# Altium schematic sheet Charging_TI_2.SchDoc
size A4
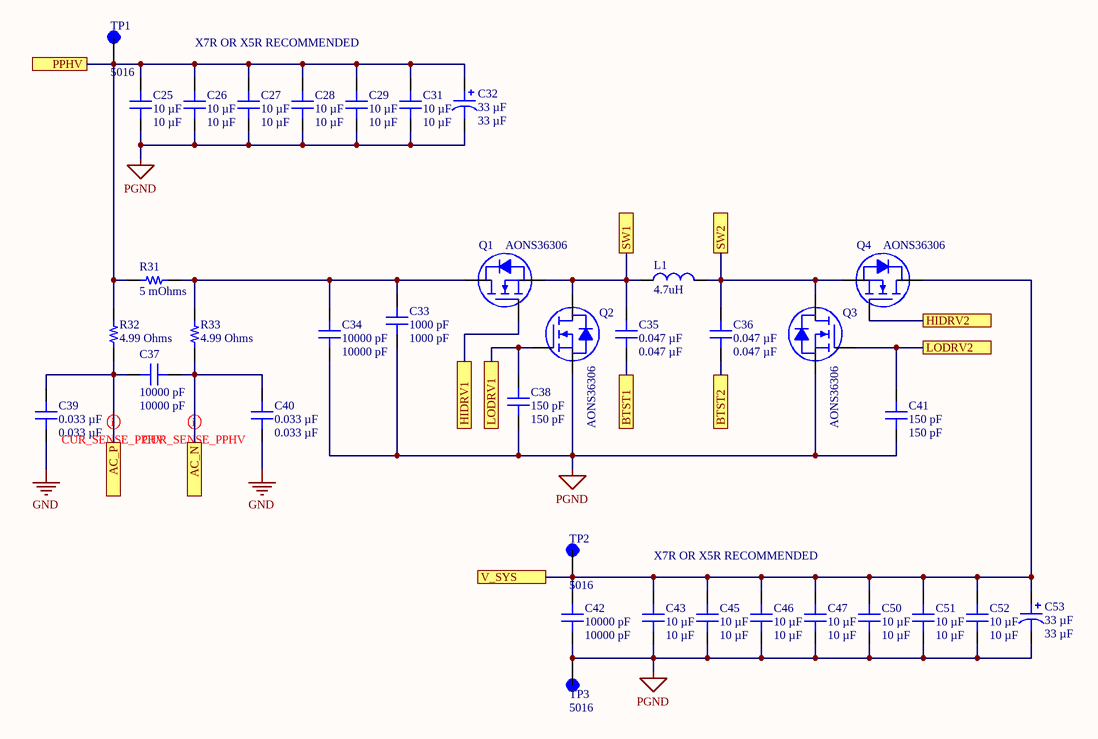
[diagram p0: Charging_TI_2.SchDoc]

## Parts
C25  10 µF  [CAP 0805_2012]
C26  10 µF  [CAP 0805_2012]
C27  10 µF  [CAP 0805_2012]
C28  10 µF  [CAP 0805_2012]
C29  10 µF  [CAP 0805_2012]
C31  10 µF  [CAP 0805_2012]
C32  33 µF  [CAP POL 2917_7343]
C33  1000 pF  [CAP 0402_1005]
C34  10000 pF  [CAP 0402_1005]
C35  0.047 µF  [CAP 0603_1608]
C36  0.047 µF  [CAP 0603_1608]
C37  10000 pF  [CAP 0603_1608]
C38  150 pF  [CAP 0603_1608]
C39  0.033 µF  [CAP 0603_1608]
C40  0.033 µF  [CAP 0603_1608]
C41  150 pF  [CAP 0603_1608]
C42  10000 pF  [CAP 0603_1608]
C43  10 µF  [CAP 0805_2012]
C45  10 µF  [CAP 0805_2012]
C46  10 µF  [CAP 0805_2012]
C47  10 µF  [CAP 0805_2012]
C50  10 µF  [CAP 0805_2012]
C51  10 µF  [CAP 0805_2012]
C52  10 µF  [CAP 0805_2012]
C53  33 µF  [CAP POL 2917_7343]
L1  4.7uH  [BMQADY1010404R7MA1]
Q1  AONS36306  [DFN 5x6]
Q2  AONS36306  [DFN 5x6]
Q3  AONS36306  [DFN 5x6]
Q4  AONS36306  [DFN 5x6]
R31  5 mOhms  [RES 1206_3216]
R32  4.99 Ohms  [RES 0603_1608]
R33  4.99 Ohms  [RES 0603_1608]
TP1  5016  [KEYSTONE_5016]  (no BOM)
TP2  5016  [KEYSTONE_5016]  (no BOM)
TP3  5016  [KEYSTONE_5016]  (no BOM)

## Ports
AC_N, AC_P, BTST1, BTST2, HIDRV1, HIDRV2, LODRV1, LODRV2, PPHV, SW1, SW2, V_SYS

## Nets
GND: C39.1 C40.1
PGND: C25.1 C26.1 C27.1 C28.1 C29.1 C31.1 C32.2 C33.1 C34.1 C38.1 C41.1 C42.1 C43.1 C45.1 C46.1 C47.1 C50.1 C51.1 C52.1 C53.2 Q2.S Q3.S TP3.TP
AC_N: C37.1 C40.2 R33.1 ; port AC_N
AC_P: C37.2 C39.2 R32.1 ; port AC_P
BTST1: C35.1 ; port BTST1
BTST2: C36.1 ; port BTST2
HIDRV1: Q1.G ; port HIDRV1
HIDRV2: Q4.G ; port HIDRV2
LODRV1: C38.2 Q2.G ; port LODRV1
LODRV2: C41.2 Q3.G ; port LODRV2
PPHV: C25.2 C26.2 C27.2 C28.2 C29.2 C31.2 C32.1 R31.1 R32.2 TP1.TP ; port PPHV
SW1: C35.2 L1.1 Q1.S Q2.D ; port SW1
SW2: C36.2 L1.2 Q3.D Q4.S ; port SW2
V_SYS: C42.2 C43.2 C45.2 C46.2 C47.2 C50.2 C51.2 C52.2 C53.1 Q4.D TP2.TP ; port V_SYS
NetC33_2: C33.2 C34.2 Q1.D R31.2 R33.2

## Layout directives
differential pair; differential pair class CUR_SENSE_PPHV: AC_N, AC_P

## Notes on the sheet
- X7R OR X5R RECOMMENDED

## Library data of the parts
C25-C29 C31 C43 C45-C47 C50-C52 = GRM21BR61H106KE43L: CAP CER 10UF 50V X5R 0805; manufacturer: Murata Electronics; Tolerance: ±10%; Part Number: GRM21BR61H106KE43L; Value: 10 µF; Applications: General Purpose; Capacitance: 10 µF; componentlink1description: Datasheet; componentlink1url: https://search.murata.co.jp/Ceramy/image/img/A01X/G101/ENG/GRM21BR61H106KE43-01A.pdf; componentlink2description: DigiKey Link; componentlink2url: https://www.digikey.com/en/products/detail/murata-electronics/GRM21BR61H106KE43L/10326316; Device Package: 0805 (2012 Metric); lastupdated: 14/08/2022 9:12:57 PM; Lifecycle Status: Active; Minimum Order: 1; Mounting Type: Surface Mount, MLCC; Operating Temperature: -55°C ~ 85°C; Package / Case: 0805 (2012 Metric); packaging: TapeAndReel; partid: 39284; Part Status: Active; price: 0.07; series: GRM; Size / Dimension: 0.079" L x 0.049" W (2.00mm x 1.25mm); Supplier 1: DigiKey; Supplier Part Number 1: 490-18663-1-ND; Temperature Coefficient: X5R; Thickness (Max): 0.057" (1.45mm); Voltage - Rated: 50V
C32 C53 = T495X336M035ATE175: CAP TANT 33UF 20% 35V 2917; manufacturer: KEMET; Manufacturer Size Code: X; ESR (Equivalent Series Resistance): 175mOhm; Lifetime @ Temp.: 2000 Hrs @ 85°C; Type: Molded; Part Number: T495X336M035ATE175; Value: 33 µF; Capacitance: 33 µF; componentlink1description: Datasheet; componentlink1url: https://api.kemet.com/component-edge/download/datasheet/T495X336M035ATE175.pdf; componentlink2description: DigiKey Link; componentlink2url: https://www.digikey.com/en/products/detail/kemet/T495X336M035ATE175/1833502; Device Package: 2917 (7343 Metric); Features: General Purpose; Height - Seated (Max): 0.169" (4.30mm); lastupdated: 14/08/2022 9:47:02 PM; Lifecycle Status: Active; Minimum Order: 1; Mounting Type: Surface Mount; Operating Temperature: -55°C ~ 125°C; Package / Case: 2917 (7343 Metric); packaging: TapeAndReel; partid: 698; Part Status: Active; price: 1.07; series: T495; Size / Dimension: 0.287" L x 0.169" W (7.30mm x 4.30mm); Supplier 1: DigiKey; Supplier Part Number 1: 399-5266-1-ND; Tolerance: ±20%; Voltage - Rated: 35 V
C33 = UMK105CG102JVHF: CAP CER 1000PF 50V NP0 0402; manufacturer: Taiyo Yuden; Temperature Coefficient: C0G, NP0; Tolerance: ±5%; Part Number: UMK105CG102JVHF; Value: 1000 pF; Applications: Automotive; Capacitance: 1000 pF; componentlink1description: Datasheet; componentlink1url: https://ds.yuden.co.jp/TYCOMPAS/ut/detail?pn=UMK105CG102JVHF &u=M; componentlink2description: DigiKey Link; componentlink2url: https://www.digikey.com/en/products/detail/taiyo-yuden/UMK105CG102JVHF/4811103; Device Package: 0402 (1005 Metric); lastupdated: 14/08/2022 9:05:57 PM; Lifecycle Status: Active; Minimum Order: 1; Mounting Type: Surface Mount, MLCC; Operating Temperature: -55°C ~ 125°C; Package / Case: 0402 (1005 Metric); packaging: TapeAndReel; partid: 1779; Part Status: Active; price: 0.01; Ratings: AEC-Q200; series: M; Size / Dimension: 0.039" L x 0.020" W (1.00mm x 0.50mm); Supplier 1: DigiKey; Supplier Part Number 1: 587-3737-1-ND; Thickness (Max): 0.022" (0.55mm); Voltage - Rated: 50V
C34 = TMK105BJ103KP-F: CAP CER 10000PF 25V X5R 0402; manufacturer: Taiyo Yuden; Tolerance: ±10%; Part Number: TMK105BJ103KP-F; Value: 10000 pF; Applications: SMPS Filtering; Capacitance: 10000 pF; componentlink1description: Datasheet; componentlink1url: https://ds.yuden.co.jp/TYCOMPAS/ut/detail?pn=TMK105BJ103KP-F  &u=M; componentlink2description: DigiKey Link; componentlink2url: https://www.digikey.com/en/products/detail/taiyo-yuden/TMK105BJ103KP-F/5182051; Device Package: 0402 (1005 Metric); lastupdated: 9/05/2023 7:07:51 PM; Lifecycle Status: Active; Minimum Order: 1; Mounting Type: Surface Mount, MLCC; Operating Temperature: -55°C ~ 85°C; Package / Case: 0402 (1005 Metric); packaging: TapeAndReel; partid: 1788; Part Status: Active; price: 0.01; series: M; Size / Dimension: 0.039" L x 0.020" W (1.00mm x 0.50mm); Supplier 1: DigiKey; Supplier Part Number 1: 587-5593-1-ND; Temperature Coefficient: X5R; Thickness (Max): 0.022" (0.55mm); Voltage - Rated: 25V
C35 C36 = C0603C473K3RACAUTO: CAP CER 0.047UF 25V X7R 0603; manufacturer: KEMET; Tolerance: ±10%; Part Number: C0603C473K3RACAUTO; Value: 0.047 µF; Applications: Automotive, Bypass, Decoupling; Capacitance: 0.047 µF; componentlink1description: Datasheet; componentlink1url: https://api.kemet.com/component-edge/download/datasheet/C0603C473K3RACAUTO.pdf; componentlink2description: DigiKey Link; componentlink2url: https://www.digikey.com/en/products/detail/kemet/C0603C473K3RACAUTO/3314894; Device Package: 0603 (1608 Metric); lastupdated: 14/08/2022 9:09:47 PM; Lifecycle Status: Active; Minimum Order: 1; Mounting Type: Surface Mount, MLCC; Operating Temperature: -55°C ~ 125°C; Package / Case: 0603 (1608 Metric); packaging: TapeAndReel; partid: 2309; Part Status: Active; price: 0.02; Ratings: AEC-Q200; series: SMD Auto X7R; Size / Dimension: 0.063" L x 0.031" W (1.60mm x 0.80mm); Supplier 1: DigiKey; Supplier Part Number 1: 399-6899-1-ND; Temperature Coefficient: X7R; Thickness (Max): 0.034" (0.87mm); Voltage - Rated: 25V
C37 C42 = CGA3E2NP01H103J080AA: CAP CER 10000PF 50V NP0 0603; manufacturer: TDK Corporation; Temperature Coefficient: C0G, NP0; Tolerance: ±5%; Part Number: CGA3E2NP01H103J080AA; Value: 10000 pF; Applications: Automotive; Capacitance: 10000 pF; componentlink1description: Datasheet; componentlink1url: https://product.tdk.com/info/en/catalog/datasheets/mlcc_automotive_hightemp_en.pdf?ref_disty=digikey; componentlink2description: DigiKey Link; componentlink2url: https://www.digikey.com/en/products/detail/tdk-corporation/CGA3E2NP01H103J080AA/3949619; Device Package: 0603 (1608 Metric); Features: High Temperature; lastupdated: 14/08/2022 9:09:46 PM; Lifecycle Status: Active; Minimum Order: 1; Mounting Type: Surface Mount, MLCC; Operating Temperature: -55°C ~ 150°C; Package / Case: 0603 (1608 Metric); packaging: TapeAndReel; partid: 2625; Part Status: Active; price: 0.08; Ratings: AEC-Q200; series: CGA; Size / Dimension: 0.063" L x 0.031" W (1.60mm x 0.80mm); Supplier 1: DigiKey; Supplier Part Number 1: 445-12383-1-ND; Thickness (Max): 0.035" (0.90mm); Voltage - Rated: 50V
C38 C41 = CC0603KRNPO9BN151: CAP CER 150PF 50V C0G/NPO 0603; manufacturer: Yageo; Temperature Coefficient: C0G, NP0; Tolerance: ±10%; Part Number: CC0603KRNPO9BN151; Value: 150 pF; Applications: General Purpose; Capacitance: 150 pF; componentlink1description: Datasheet; componentlink1url: https://www.yageo.com/upload/media/product/productsearch/datasheet/mlcc/UPY-GP_NP0_16V-to-50V_17.pdf; componentlink2description: DigiKey Link; componentlink2url: https://www.digikey.com/en/products/detail/yageo/CC0603KRNPO9BN151/5883706; Device Package: 0603 (1608 Metric); lastupdated: 14/08/2022 9:09:44 PM; Lifecycle Status: Active; Minimum Order: 1; Mounting Type: Surface Mount, MLCC; Operating Temperature: -55°C ~ 125°C; Package / Case: 0603 (1608 Metric); packaging: TapeAndReel; partid: 3558; Part Status: Active; price: 0.01; series: CC; Size / Dimension: 0.063" L x 0.031" W (1.60mm x 0.80mm); Supplier 1: DigiKey; Supplier Part Number 1: 311-4029-1-ND; Thickness (Max): 0.035" (0.90mm); Voltage - Rated: 50V
C39 C40 = C0603C333K5RACAUTO: CAP CER 0.033UF 50V X7R 0603; manufacturer: KEMET; Tolerance: ±10%; Part Number: C0603C333K5RACAUTO; Value: 0.033 µF; Applications: Automotive, Bypass, Decoupling; Capacitance: 0.033 µF; componentlink1description: Datasheet; componentlink1url: https://api.kemet.com/component-edge/download/datasheet/C0603C333K5RACAUTO.pdf; componentlink2description: DigiKey Link; componentlink2url: https://www.digikey.com/en/products/detail/kemet/C0603C333K5RACAUTO/3314880; Device Package: 0603 (1608 Metric); lastupdated: 14/08/2022 9:09:47 PM; Lifecycle Status: Active; Minimum Order: 1; Mounting Type: Surface Mount, MLCC; Operating Temperature: -55°C ~ 125°C; Package / Case: 0603 (1608 Metric); packaging: TapeAndReel; partid: 2224; Part Status: Active; price: 0.01; Ratings: AEC-Q200; series: SMD Auto X7R; Size / Dimension: 0.063" L x 0.031" W (1.60mm x 0.80mm); Supplier 1: DigiKey; Supplier Part Number 1: 399-6884-1-ND; Temperature Coefficient: X7R; Thickness (Max): 0.034" (0.87mm); Voltage - Rated: 50V
L1 = BMQADY1010404R7MA1
Q1-Q4 = AONS36306: 30V N-Channel MOSFET
R31 = PMR18EZPJU5L0: RES 0.005 OHM 5% 1W 1206; Manufacturer: Rohm Semiconductor; Temperature Coefficient: ±100ppm/°C; Part Number: PMR18EZPJU5L0; ComponentLink1Description: Datasheet; ComponentLink1URL: https://www.rohm.com/datasheet/PMR18EZPFV/pmr-e; ComponentLink2Description: DigiKey Link; ComponentLink2URL: https://www.digikey.com/en/products/detail/rohm-semiconductor/PMR18EZPJU5L0/2094212; Composition: Metal Element; Device Package: 1206 (3216 Metric); Features: Automotive AEC-Q200, Current Sense; Height - Seated (Max): 0.017" (0.43mm); LastUpdated: 14/08/2022 9:38:16 PM; Lifecycle Status: Active; Minimum Order: 1; Number of Terminations: 2; Operating Temperature: -55°C ~ 155°C; Package / Case: 1206 (3216 Metric); Packaging: TapeAndReel; PartId: 27011; Part Status: Active; Power (Watts): 1W; Price: 0.11; Ratings: AEC-Q200; Resistance: 5 mOhms; Series: PMR; Size / Dimension: 0.126" L x 0.063" W (3.20mm x 1.60mm); Supplier 1: DigiKey; Supplier Part Number 1: RHM.005AMCT-ND; Supplier Device Package: 1206; Tolerance: ±5%; Value: 5 mOhms
R32 R33 = RC0603FR-074R99L: RES 4.99 OHM 1% 1/10W 0603; Manufacturer: Yageo; Power (Watts): 0.1W, 1/10W; Temperature Coefficient: ±200ppm/°C; Part Number: RC0603FR-074R99L; Value: 4.99 Ohms; ComponentLink1Description: Datasheet; ComponentLink1URL: https://www.yageo.com/upload/media/product/productsearch/datasheet/rchip/PYu-RC_Group_51_RoHS_L_10.pdf; ComponentLink2Description: DigiKey Link; ComponentLink2URL: https://www.digikey.com/en/products/detail/yageo/RC0603FR-074R99L/727218; Composition: Thick Film; Device Package: 0603 (1608 Metric); Features: Moisture Resistant; Height - Seated (Max): 0.022" (0.55mm); LastUpdated: 14/08/2022 9:31:08 PM; Lifecycle Status: Active; Minimum Order: 1; Number of Terminations: 2; Operating Temperature: -55°C ~ 155°C; Package / Case: 0603 (1608 Metric); Packaging: TapeAndReel; PartId: 12919; Part Status: Active; Price: 0.01; Resistance: 4.99 Ohms; Series: RC_L; Size / Dimension: 0.063" L x 0.031" W (1.60mm x 0.80mm); Supplier 1: DigiKey; Supplier Part Number 1: 311-4.99HRCT-ND; Supplier Device Package: 0603; Tolerance: ±1%
TP1-TP3 = 5016: MF: {'manufacturer': u'Keystone Electronics'}; Package: None; MP: 5016; Value: *; Price: None; Availability: Unavailable